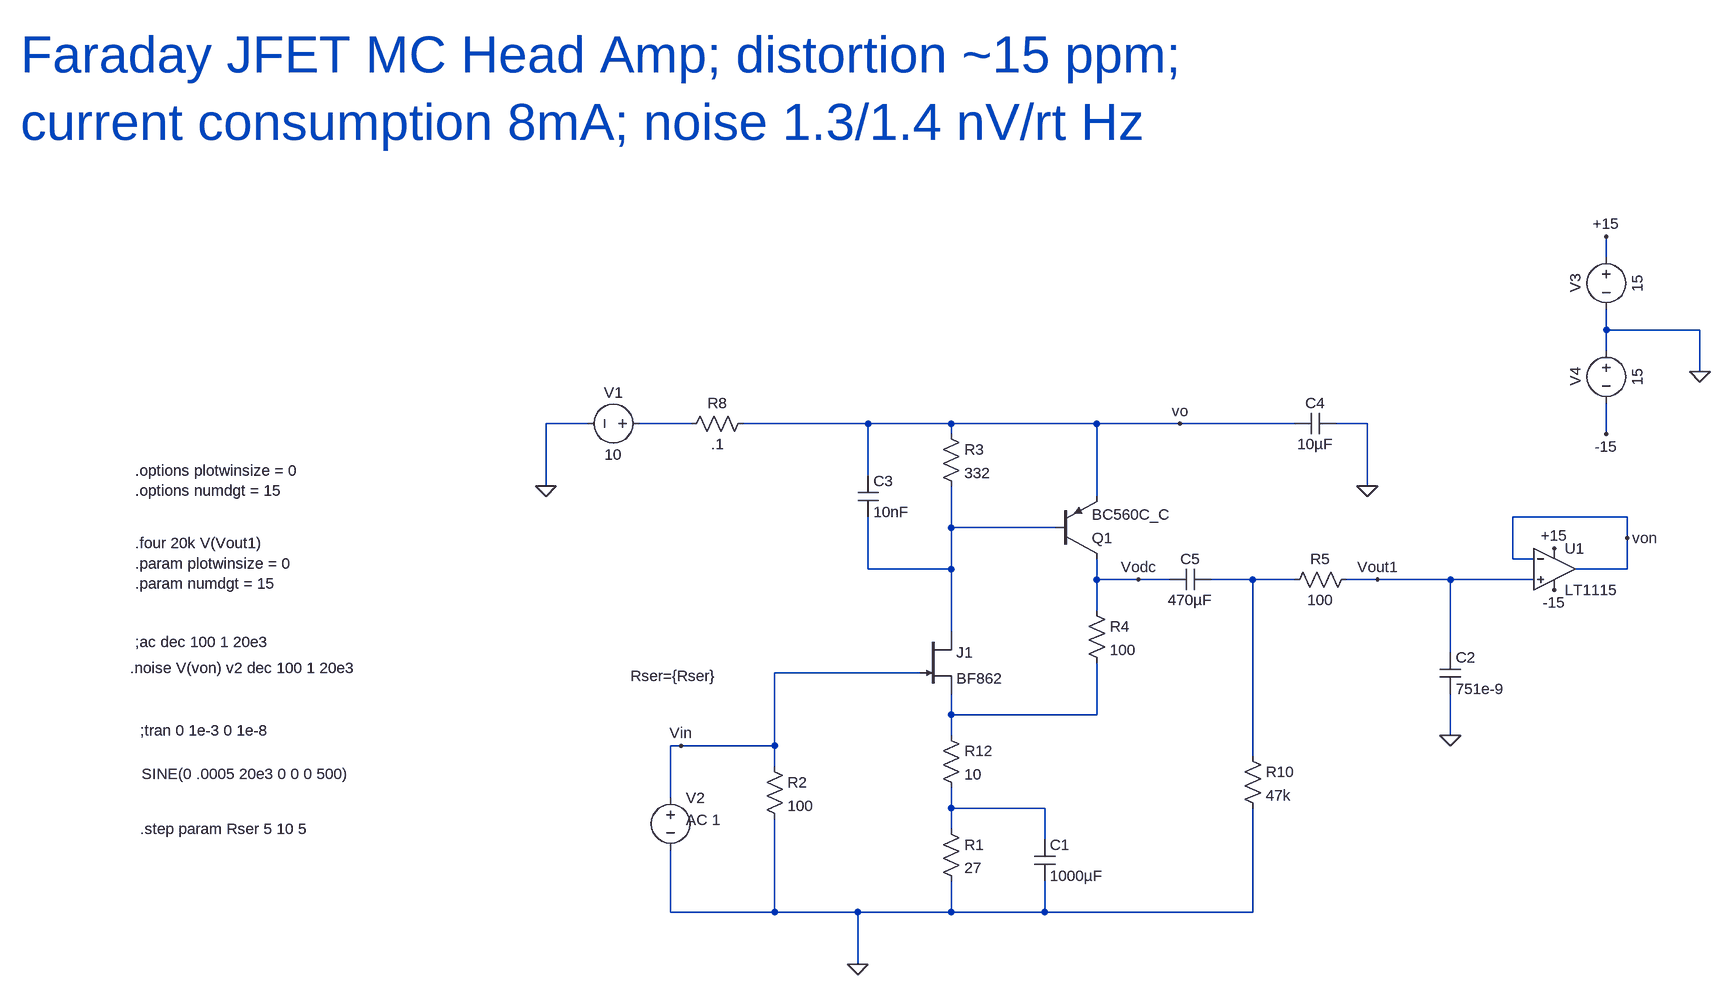
[diagram p0: schematic Faraday_comp.asc]
Faraday_comp.asc, the LTspice schematic file:
Version 4
SHEET 1 2396 680
WIRE 1616 -640 1616 -672
WIRE 1616 -528 1616 -560
WIRE 1760 -528 1616 -528
WIRE 1616 -496 1616 -528
WIRE 1760 -464 1760 -528
WIRE 48 -384 -16 -384
WIRE 208 -384 128 -384
WIRE 480 -384 288 -384
WIRE 608 -384 480 -384
WIRE 832 -384 608 -384
WIRE 960 -384 832 -384
WIRE 1136 -384 960 -384
WIRE 1248 -384 1200 -384
WIRE 608 -368 608 -384
WIRE 1616 -368 1616 -416
WIRE 480 -304 480 -384
WIRE -16 -288 -16 -384
WIRE 1248 -288 1248 -384
WIRE 832 -272 832 -384
WIRE 1648 -240 1472 -240
WIRE 608 -224 608 -288
WIRE 768 -224 608 -224
WIRE 1648 -208 1648 -240
WIRE 1472 -176 1472 -240
WIRE 1504 -176 1472 -176
WIRE 480 -160 480 -240
WIRE 608 -160 608 -224
WIRE 608 -160 480 -160
WIRE 1648 -160 1648 -208
WIRE 1648 -160 1568 -160
WIRE 832 -144 832 -176
WIRE 896 -144 832 -144
WIRE 944 -144 896 -144
WIRE 1072 -144 1008 -144
WIRE 1136 -144 1072 -144
WIRE 1264 -144 1216 -144
WIRE 1376 -144 1264 -144
WIRE 1504 -144 1376 -144
WIRE 832 -96 832 -144
WIRE 608 -64 608 -160
WIRE 1376 -32 1376 -144
WIRE 560 0 336 0
WIRE 608 64 608 32
WIRE 832 64 832 -16
WIRE 832 64 608 64
WIRE 608 96 608 64
WIRE 1376 96 1376 32
WIRE 192 112 176 112
WIRE 336 112 336 0
WIRE 336 112 192 112
WIRE 1072 128 1072 -144
WIRE 336 144 336 112
WIRE 176 192 176 112
WIRE 608 208 608 176
WIRE 752 208 608 208
WIRE 608 240 608 208
WIRE 752 256 752 208
WIRE 176 368 176 272
WIRE 336 368 336 224
WIRE 336 368 176 368
WIRE 464 368 336 368
WIRE 608 368 608 320
WIRE 608 368 464 368
WIRE 752 368 752 320
WIRE 752 368 608 368
WIRE 1072 368 1072 208
WIRE 1072 368 752 368
WIRE 464 448 464 368
FLAG 464 448 0
FLAG -16 -288 0
FLAG 1248 -288 0
FLAG 1264 -144 Vout1
FLAG 896 -144 Vodc
FLAG 960 -384 vo
FLAG 192 112 Vin
FLAG 1376 96 0
FLAG 1760 -464 0
FLAG 1616 -672 +15
FLAG 1536 -192 +15
FLAG 1616 -368 -15
FLAG 1536 -128 -15
FLAG 1648 -208 von
SYMBOL njf 560 -64 R0
SYMATTR InstName J1
SYMATTR Value BF862
SYMBOL res 592 224 R0
SYMATTR InstName R1
SYMATTR Value 27
SYMBOL res 592 -384 R0
SYMATTR InstName R3
SYMATTR Value 332
SYMBOL voltage 144 -384 R90
WINDOW 0 -32 56 VBottom 2
WINDOW 3 32 56 VTop 2
WINDOW 123 2 56 VBottom 2
WINDOW 39 0 0 Left 2
SYMATTR InstName V1
SYMATTR Value 10
SYMBOL voltage 176 176 R0
WINDOW 3 -814 -21 Left 2
WINDOW 123 24 50 Left 2
WINDOW 39 -62 -172 Left 2
SYMATTR Value SINE(0 .0005 20e3 0 0 0 500)
SYMATTR Value2 AC 1
SYMATTR SpiceLine Rser={Rser}
SYMATTR InstName V2
SYMBOL cap 1200 -400 R90
WINDOW 0 0 32 VBottom 2
WINDOW 3 32 32 VTop 2
SYMATTR InstName C4
SYMATTR Value 10µF
SYMBOL pnp 768 -176 M180
SYMATTR InstName Q1
SYMATTR Value BC560C_C
SYMBOL res 320 128 R0
SYMATTR InstName R2
SYMATTR Value 100
SYMBOL res 816 -112 R0
SYMATTR InstName R4
SYMATTR Value 100
SYMBOL cap 464 -304 R0
SYMATTR InstName C3
SYMATTR Value 10nF
SYMBOL cap 1008 -160 R90
WINDOW 0 0 32 VBottom 2
WINDOW 3 32 32 VTop 2
SYMATTR InstName C5
SYMATTR Value 470µF
SYMBOL res 1056 112 R0
SYMATTR InstName R10
SYMATTR Value 47k
SYMBOL res 304 -400 R90
WINDOW 0 0 56 VBottom 2
WINDOW 3 32 56 VTop 2
SYMATTR InstName R8
SYMATTR Value .1
SYMBOL res 592 80 R0
SYMATTR InstName R12
SYMATTR Value 10
SYMBOL cap 736 256 R0
SYMATTR InstName C1
SYMATTR Value 1000µF
SYMBOL res 1232 -160 R90
WINDOW 0 0 56 VBottom 2
WINDOW 3 32 56 VTop 2
SYMATTR InstName R5
SYMATTR Value 100
SYMBOL Opamps\\LT1115 1536 -224 R0
SYMATTR InstName U1
SYMBOL cap 1360 -32 R0
SYMATTR InstName C2
SYMATTR Value 751e-9
SYMBOL voltage 1616 -656 R0
WINDOW 0 -32 56 VBottom 2
WINDOW 3 32 56 VTop 2
WINDOW 123 2 56 VBottom 2
WINDOW 39 0 0 Left 2
SYMATTR InstName V3
SYMATTR Value 15
SYMBOL voltage 1616 -512 R0
WINDOW 0 -32 56 VBottom 2
WINDOW 3 32 56 VTop 2
WINDOW 123 2 56 VBottom 2
WINDOW 39 0 0 Left 2
SYMATTR InstName V4
SYMATTR Value 15
TEXT -648 -48 Left 2 !;ac dec 100 1 20e3
TEXT -640 88 Left 2 !;tran 0 1e-3 0 1e-8
TEXT -656 -8 Left 2 !.noise V(von) v2 dec 100 1 20e3
TEXT -648 -200 Left 2 !.four 20k V(Vout1)\n.param plotwinsize = 0\n.param numdgt = 15
TEXT -648 -312 Left 2 !.options plotwinsize = 0\n.options numdgt = 15
TEXT -640 240 Left 2 !.step param Rser 5 10 5
TEXT -824 -952 Left 6 ;Faraday JFET MC Head Amp; distortion ~15 ppm; \ncurrent consumption 8mA; noise 1.3/1.4 nV/rt Hz

The netlist it stands for:
* Faraday_comp.asc
J1 N002 Vin N004 BF862
R1 N005 0 27
R3 vo N002 332
V1 N001 0 10
V2 Vin 0 SINE(0 .0005 20e3 0 0 0 500) AC 1 Rser={Rser}
C4 0 vo 10µF
Q1 Vodc N002 vo 0 BC560C_C
R2 Vin 0 100
R4 Vodc N004 100
C3 vo N002 10nF
C5 N003 Vodc 470µF
R10 N003 0 47k
R8 vo N001 .1
R12 N004 N005 10
C1 N005 0 1000µF
R5 Vout1 N003 100
XU1 Vout1 von +15 -15 von LT1028  ; LT1115, pins In+ In- V+ V- OUT
C2 Vout1 0 751e-9
V3 +15 0 15
V4 0 -15 15
.model NPN NPN
.model PNP PNP
.lib standard.bjt
.model NJF NJF
.model PJF PJF
.lib standard.jft
;ac dec 100 1 20e3
;tran 0 1e-3 0 1e-8
.noise V(von) v2 dec 100 1 20e3
.four 20k V(Vout1)
.param plotwinsize = 0
.param numdgt = 15
.options plotwinsize = 0
.options numdgt = 15
.step param Rser 5 10 5
* Faraday JFET MC Head Amp; distortion ~15 ppm;
* current consumption 8mA; noise 1.3/1.4 nV/rt Hz
.lib LTC.lib
.backanno
.end